# Altium project EaglesPU50.PrjPcb
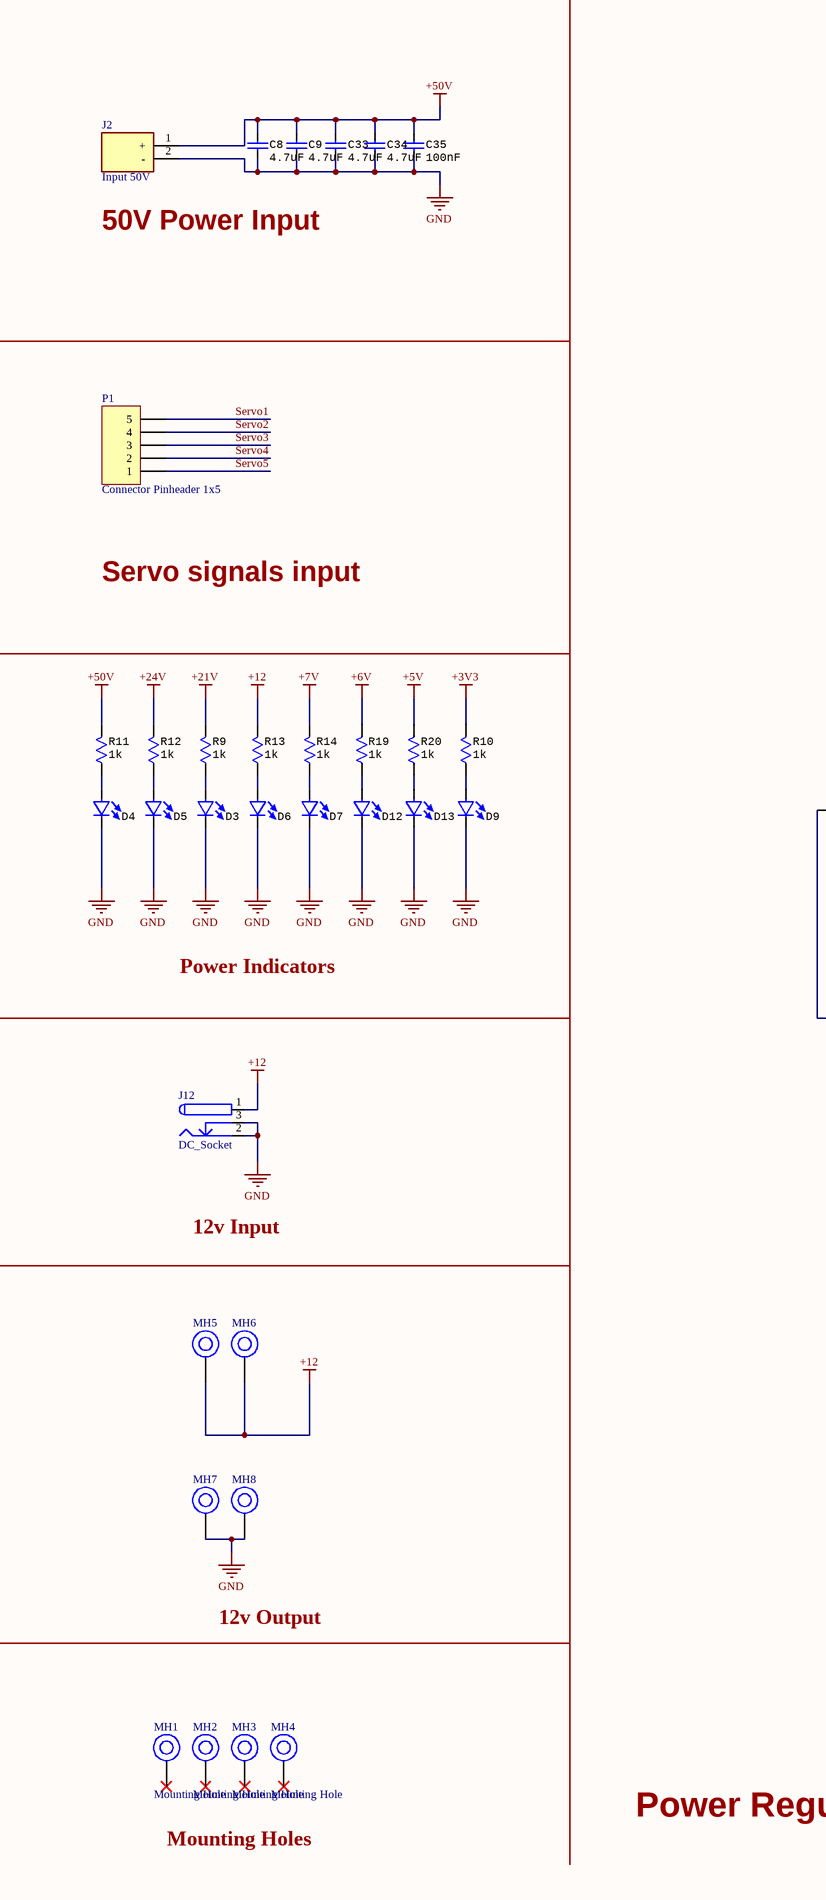
[diagram p0: EaglesPU50.SchDoc, left]
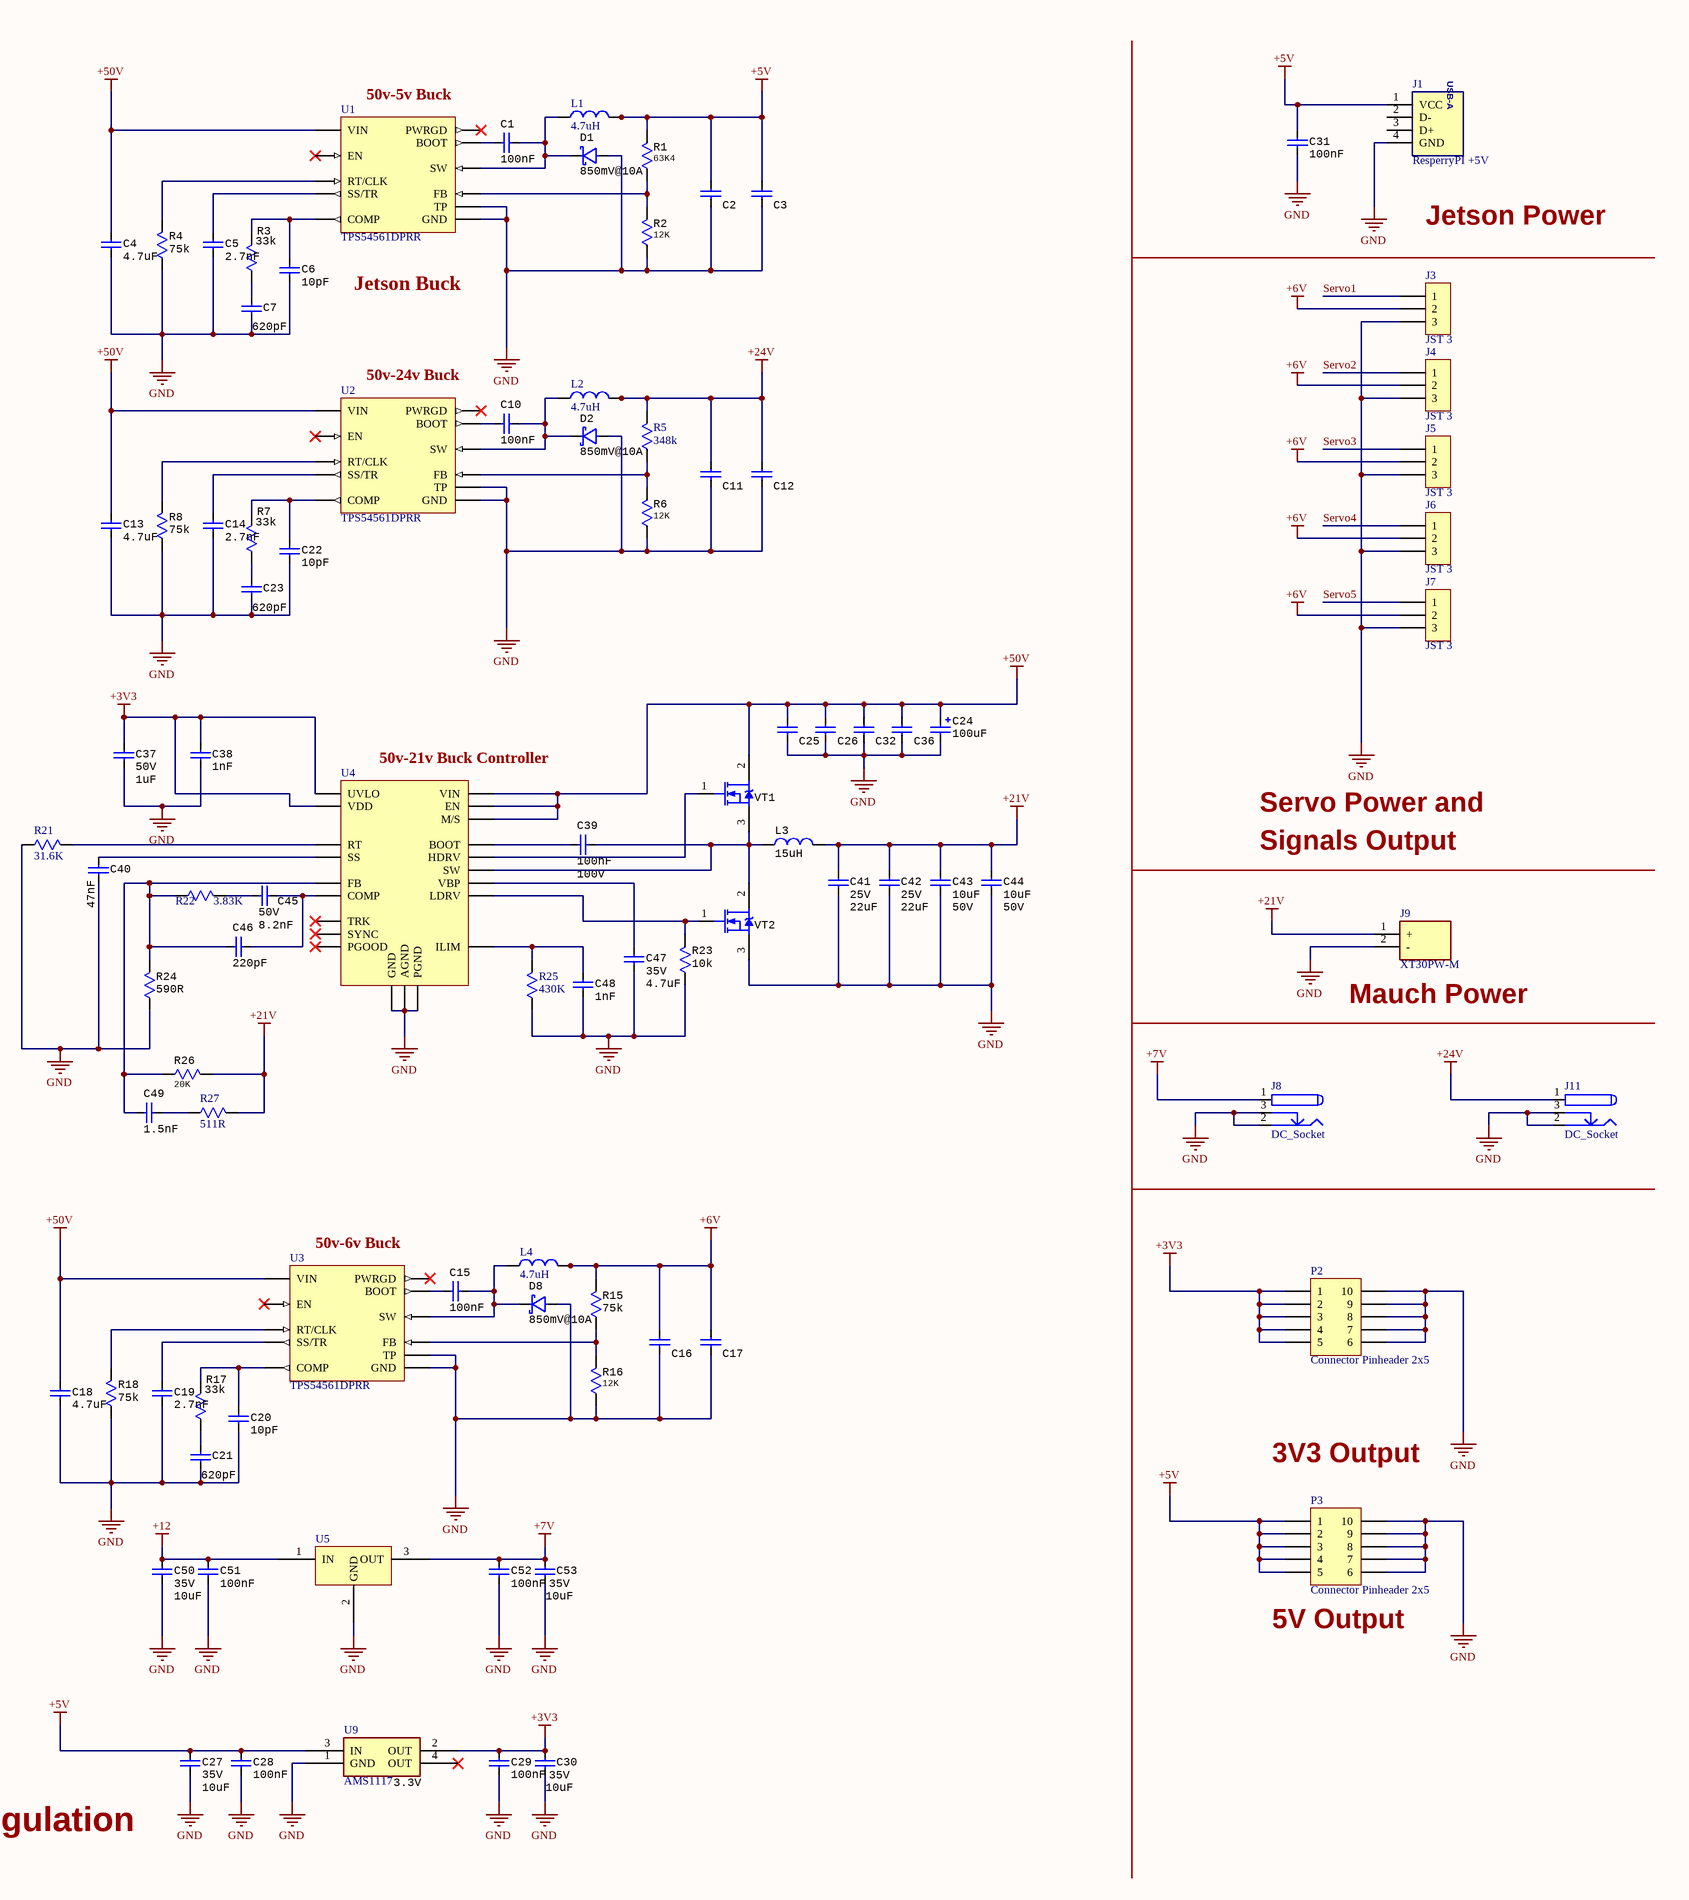
[diagram p1: EaglesPU50.SchDoc, right]
1 sheet, 125 parts. Net scope: global (net labels, ports and power ports of the same name join across sheets).
Board file: PU50.PcbDoc

## Sheet EaglesPU50.SchDoc
size C; SheetNumber: 1; SheetTotal: 1

### Parts
C1  100nF  [CAP Ceramic SMD 0603]
C2  (no value)  [CAP Ceramic SMD 1206]
C3  (no value)  [CAP Ceramic SMD 1206]
C4  4.7uF  [CAP Ceramic SMD 1206]
C5  2.7nF  [CAP Ceramic SMD 0603]
C6  10pF  [CAP Ceramic SMD 0603]
C7  620pF  [CAP Ceramic SMD 0603]
C8  4.7uF  [CAP Ceramic SMD 1206]
C9  4.7uF  [CAP Ceramic SMD 1206]
C10  100nF  [CAP Ceramic SMD 0603]
C11  (no value)  [CAP Ceramic SMD 1206]
C12  (no value)  [CAP Ceramic SMD 1206]
C13  4.7uF  [CAP Ceramic SMD 1206]
C14  2.7nF  [CAP Ceramic SMD 0603]
C15  100nF  [CAP Ceramic SMD 0603]
C16  (no value)  [CAP Ceramic SMD 1206]
C17  (no value)  [CAP Ceramic SMD 1206]
C18  4.7uF  [CAP Ceramic SMD 1206]
C19  2.7nF  [CAP Ceramic SMD 0603]
C20  10pF  [CAP Ceramic SMD 0603]
C21  620pF  [CAP Ceramic SMD 0603]
C22  10pF  [CAP Ceramic SMD 0603]
C23  620pF  [CAP Ceramic SMD 0603]
C24  100uF  [CAP Electrolytic SMD G_10X10.3X10.2(CPOL-EU153CLV-1010)]
C25  2.2uF  [CAP Ceramic SMD 1206]  (value not drawn)
C26  2.2uF  [CAP Ceramic SMD 1206]  (value not drawn)
C27  Voltage: 35V  [CAP Ceramic SMD 0603]  (hidden comment: 10uF)
C28  100nF  [CAP Ceramic SMD 0603]
C29  100nF  [CAP Ceramic SMD 0603]
C30  Voltage: 35V  [CAP Ceramic SMD 0603]  (hidden comment: 10uF)
C31  100nF  [CAP Ceramic SMD 0603]
C32  2.2uF  [CAP Ceramic SMD 1206]  (value not drawn)
C33  4.7uF  [CAP Ceramic SMD 1206]
C34  4.7uF  [CAP Ceramic SMD 1206]
C35  100nF  [CAP Ceramic SMD 0603]
C36  2.2uF  [CAP Ceramic SMD 1206]  (value not drawn)
C37  value 1uF  Voltage: 50V  [CAP Ceramic SMD 0603]
C38  1nF  [CAP Ceramic SMD 0603]
C39  value 100nF  Voltage: 100V  [CAP Ceramic SMD 0603]
C40  47nF  [CAP Ceramic SMD 0603]
C41  Voltage: 25V  [CAP Ceramic SMD 0805]  (hidden comment: 22uF)
C42  Voltage: 25V  [CAP Ceramic SMD 0805]  (hidden comment: 22uF)
C43  value 10uF  Voltage: 50V  [CAP Ceramic SMD 1206]
C44  value 10uF  Voltage: 50V  [CAP Ceramic SMD 1206]
C45  Voltage: 50V  [CAP Ceramic SMD 0603]  (hidden comment: 8.2nF)
C46  220pF  [CAP Ceramic SMD 0603]
C47  value 4.7uF  Voltage: 35V  [CAP Ceramic SMD 0603]
C48  1nF  [CAP Ceramic SMD 0603]
C49  1.5nF  [CAP Ceramic SMD 0603]
C50  Voltage: 35V  [CAP Ceramic SMD 0603]  (hidden comment: 10uF)
C51  100nF  [CAP Ceramic SMD 0603]
C52  100nF  [CAP Ceramic SMD 0603]
C53  Voltage: 35V  [CAP Ceramic SMD 0603]  (hidden comment: 10uF)
D1  850mV@10A  [TO-277]
D2  850mV@10A  [TO-277]
D3  (no value)  [LED SMD 0805G]
D4  (no value)  [LED SMD 0805G]
D5  (no value)  [LED SMD 0805G]
D6  (no value)  [LED SMD 0805G]
D7  (no value)  [LED SMD 0805G]
D8  850mV@10A  [TO-277]
D9  (no value)  [LED SMD 0805G]
D12  (no value)  [LED SMD 0805G]
D13  (no value)  [LED SMD 0805G]
J1  ResperryPI +5V  [USB-A/S_A]
J2  Input 50V  [XT60PW-M]
J3  JST 3  [VH3.96-3AW]
J4  JST 3  [VH3.96-3AW]
J5  JST 3  [VH3.96-3AW]
J6  JST 3  [VH3.96-3AW]
J7  JST 3  [VH3.96-3AW]
J8  DC_Socket  [DC-002]
J9  XT30PW-M  [AMASS_XT30PW-F]
J11  DC_Socket  [DC-002]
J12  DC_Socket  [DC-002]
L1  4.7uH  [XLS1040]
L2  4.7uH  [XLS1040]
L3  15uH  [MDA1365-150M]
L4  4.7uH  [XLS1040]
MH1  Mounting Hole  [Connector Mounting hole TH 3mm]  (no BOM)
MH2  Mounting Hole  [Connector Mounting hole TH 3mm]  (no BOM)
MH3  Mounting Hole  [Connector Mounting hole TH 3mm]  (no BOM)
MH4  Mounting Hole  [Connector Mounting hole TH 3mm]  (no BOM)
MH5  Mounting Hole  [Connector Mounting hole TH 1mm SOLID]  (value not drawn)  (no BOM)
MH6  Mounting Hole  [Connector Mounting hole TH 1mm SOLID]  (value not drawn)  (no BOM)
MH7  Mounting Hole  [Connector Mounting hole TH 1mm SOLID]  (value not drawn)  (no BOM)
MH8  Mounting Hole  [Connector Mounting hole TH 1mm SOLID]  (value not drawn)  (no BOM)
P1  Connector Pinheader 1x5  [Header 2.54X5]
P2  Connector Pinheader 2x5  [Header 2.54_2X5]
P3  Connector Pinheader 2x5  [Header 2.54_2X5]
R1  63K4  [RES SMD 0603]
R2  12K  [RES SMD 0603]
R3  33k  [RES SMD 0603]
R4  value 75k  [RES SMD 0603]  (hidden comment: 75kR)
R5  348k  [RES SMD 0805]
R6  12K  [RES SMD 0603]
R7  33k  [RES SMD 0603]
R8  value 75k  [RES SMD 0603]  (hidden comment: 75kR)
R9  value 1k  [RES SMD 0603]  (hidden comment: 1kR)
R10  value 1k  [RES SMD 0603]  (hidden comment: 1kR)
R11  value 1k  [RES SMD 0603]  (hidden comment: 1kR)
R12  value 1k  [RES SMD 0603]  (hidden comment: 1kR)
R13  value 1k  [RES SMD 0603]  (hidden comment: 1kR)
R14  value 1k  [RES SMD 0603]  (hidden comment: 1kR)
R15  value 75k  [RES SMD 0603]  (hidden comment: 75kR)
R16  12K  [RES SMD 0603]
R17  33k  [RES SMD 0603]
R18  value 75k  [RES SMD 0603]  (hidden comment: 75kR)
R19  value 1k  [RES SMD 0603]  (hidden comment: 1kR)
R20  value 1k  [RES SMD 0603]  (hidden comment: 1kR)
R21  31.6K  [RES SMD 0603]
R22  3.83K  [RES SMD 0603]
R23  10k  [RES SMD 0603]
R24  590R  [RES SMD 0603]
R25  430K  [RES SMD 0805]
R26  20K  [RES SMD 0603]
R27  511R  [RES SMD 0603]
U1  TPS54561DPRR  [TPS54561DPRR]
U2  TPS54561DPRR  [TPS54561DPRR]
U3  TPS54561DPRR  [TPS54561DPRR]
U4  TPS40170RGYR  [TPS40170RGYR]  (value not drawn)
U5  BA7807FP-E2  [BA7807FP-E2]  (value not drawn)
U9  AMS1117  Voltage output: 3.3V  [Linear reagulator SMD AMS1117 - duplicate]
VT1  SL15N65CD  [TO252]  (value not drawn)
VT2  SL15N65CD  [TO252]  (value not drawn)

### Nets
+3V3: C29.1 C30.1 C37.1 C38.1 P2.1 P2.2 P2.3 P2.4 P2.5 R10.2 U4.10(VDD) U4.20(UVLO) U9.2(OUT)
+5V: C2.1 C3.1 C27.1 C28.1 C31.1 J1.1(VCC) L1.1 P3.1 P3.2 P3.3 P3.4 P3.5 R1.2 R20.2 U9.3(IN)
+6V: C16.1 C17.1 J3.2 J4.2 J5.2 J6.2 J7.2 L4.1 R15.2 R19.2
+7V: C52.1 C53.1 J8.1 R14.2 U5.3(OUT)
+12: C50.1 C51.1 J12.1 MH5.1 MH6.1 R13.2 U5.1(IN)
+21V: C41.1 C42.1 C43.1 C44.1 J9.1(+) L3.1 R9.2 R26.2 R27.2
+24V: C11.1 C12.1 J11.1 L2.1 R5.2 R12.2
+50V: C4.1 C8.1 C9.1 C13.1 C18.1 C24.1 C25.1 C26.1 C32.1 C33.1 C34.1 C35.1 C36.1 J2.1(+) R11.2 U1.2(VIN) U2.2(VIN) U3.2(VIN) U4.1(EN) U4.3(M/S) U4.19(VIN) VT1.2(D)
GND: C2.2 C3.2 C4.2 C5.2 C6.2 C7.2 C8.2 C9.2 C11.2 C12.2 C13.2 C14.2 C16.2 C17.2 C18.2 C19.2 C20.2 C21.2 C22.2 C23.2 C24.2 C25.2 C26.2 C27.2 C28.2 C29.2 C30.2 C31.2 C32.2 C33.2 C34.2 C35.2 C36.2 C37.2 C38.2 C40.2 C41.2 C42.2 C43.2 C44.2 C47.2 C48.2 C50.2 C51.2 C52.2 C53.2 D1.A D2.A D3.2 D4.2 D5.2 D6.2 D7.2 D8.A D9.2 D12.2 D13.2 J1.4(GND) J2.2(-) J3.3 J4.3 J5.3 J6.3 J7.3 J8.2 J8.3 J9.2(-) J11.2 J11.3 J12.2 J12.3 MH7.1 MH8.1 P2.6 P2.7 P2.8 P2.9 P2.10 P3.6 P3.7 P3.8 P3.9 P3.10 R2.1 R4.1 R6.1 R8.1 R16.1 R18.1 R21.1 R23.1 R24.1 R25.1 U1.8(GND) U1.11(TP) U2.8(GND) U2.11(TP) U3.8(GND) U3.11(TP) U4.9(AGND) U4.13(PGND) U4.21(GND) U5.2(GND) U9.1(GND) VT2.3(S)
Servo1: J3.1 P1.5
Servo2: J4.1 P1.4
Servo3: J5.1 P1.3
Servo4: J6.1 P1.2
Servo5: J7.1 P1.1
NetC1_1: C1.1 U1.1(BOOT)
NetC1_2: C1.2 D1.C L1.2 U1.9(SW)
NetC5_1: C5.1 U1.4(SS/TR)
NetC6_1: C6.1 R3.2 U1.7(COMP)
NetC7_1: C7.1 R3.1
NetC10_1: C10.1 U2.1(BOOT)
NetC10_2: C10.2 D2.C L2.2 U2.9(SW)
NetC14_1: C14.1 U2.4(SS/TR)
NetC15_1: C15.1 U3.1(BOOT)
NetC15_2: C15.2 D8.C L4.2 U3.9(SW)
NetC19_1: C19.1 U3.4(SS/TR)
NetC20_1: C20.1 R17.2 U3.7(COMP)
NetC21_1: C21.1 R17.1
NetC22_1: C22.1 R7.2 U2.7(COMP)
NetC23_1: C23.1 R7.1
NetC39_1: C39.1 U4.18(BOOT)
NetC39_2: C39.2 L3.2 U4.16(SW) VT1.3(S) VT2.2(D)
NetC40_1: C40.1 U4.5(SS)
NetC45_1: C45.1 C46.2 U4.8(COMP)
NetC45_2: C45.2 R22.2
NetC46_1: C46.1 C49.1 R22.1 R24.2 R26.1 U4.7(FB)
NetC47_1: C47.1 U4.15(VBP)
NetC48_1: C48.1 R25.2 U4.12(ILIM)
NetC49_2: C49.2 R27.1
NetD3_1: D3.1 R9.1
NetD4_1: D4.1 R11.1
NetD5_1: D5.1 R12.1
NetD6_1: D6.1 R13.1
NetD7_1: D7.1 R14.1
NetD9_1: D9.1 R10.1
NetD12_1: D12.1 R19.1
NetD13_1: D13.1 R20.1
NetR1_1: R1.1 R2.2 U1.6(FB)
NetR4_2: R4.2 U1.5(RT/CLK)
NetR5_1: R5.1 R6.2 U2.6(FB)
NetR8_2: R8.2 U2.5(RT/CLK)
NetR15_1: R15.1 R16.2 U3.6(FB)
NetR18_2: R18.2 U3.5(RT/CLK)
NetR21_2: R21.2 U4.4(RT)
NetR23_2: R23.2 U4.14(LDRV) VT2.1(G)
NetU4_17: U4.17(HDRV) VT1.1(G)

Not connected (* = marked no-connect by the designer): J1 2(D-) 3(D+); MH1 1*; MH2 1*; MH3 1*; MH4 1*; U1 3(EN)* 10(PWRGD)*; U2 3(EN)* 10(PWRGD)*; U3 3(EN)* 10(PWRGD)*; U4 2(SYNC)* 6(TRK)* 11(PGOOD)*; U9 4(OUT)*

### Notes on the sheet
- (near U1) 50v-5v Buck
- 50V Power Input
- Jetson Power
- Jetson Buck
- (near U2) 50v-24v Buck
- Servo signals input
- (near U4) 50v-21v Buck Controller
- Servo Power and
- Signals Output
- Power Indicators
- (near J9) Mauch Power
- 12v Input
- (near U3) 50v-6v Buck
- 3V3 Output
- 12v Output
- (near P3) 5V Output
- Mounting Holes
- Power Regulation
- (in symbol Connector_USB-A) USB-A

### Library data of the parts
C1 C10 C15 C31 C35 = CAP 0603 100nF 100V: 0603 0.1 uF 100 V ±10% Tolerance X7R Multilayer Ceramic Capacitor; Manufacturer: Yageo; Manufacturer Part Number: CC0603KRX7R0BB104; Voltage Rating: 100V; RoHS: Yes; Category: Ceramic Capacitors; Stock 1: 6927977; Pricing 1: 1=0.17000, 10=0.11900, 50=0.06760, 100=0.05590, 500=0.03922, 1000=0.03246 (USD); Mount: Surface Mount; Case/Package: 0603; Case Code (Metric): 1608; Case Code (Imperial): 0603; Weight: 7.1E-05oz; Min Operating Temperature: -55°C; Max Operating Temperature: 125°C; Package Quantity: 4000; Capacitance: 100nF; Tolerance: 10%; Packaging: Tape and Reel; Dielectric: X7R; Termination: SMD/SMT; Resistor Type: Ceramic; Voltage Rating (DC): 100V; Series: CC; Length: 0.063inch; Width: 0.031inch; Thickness: 0.035inch; Depth: 0.8mm; Lead Free: Lead Free; RoHS Compliant: Yes; ComponentLink1URL: https://datasheet.ciiva.com/6277/mlccorderingcode-6277082.pdf?src-supplier=Digi-Key; ComponentLink1Description: https://datasheet.ciiva.com/6277/mlccorderingcode-6277082.pdf?src-supplier=Digi-Key; ComponentLink2URL: https://datasheet.ciiva.com/6277/mlccorderingcode-6277081.pdf?src-supplier=Digi-Key; ComponentLink2Description: https://datasheet.ciiva.com/6277/mlccorderingcode-6277081.pdf?src-supplier=Digi-Key; ComponentLink3URL: https://datasheet.ciiva.com/6277/mlccorderingcode-6277030.pdf?src-supplier=Digi-Key; ComponentLink3Description: https://datasheet.ciiva.com/6277/mlccorderingcode-6277030.pdf?src-supplier=Digi-Key; Supplier 1: LCSC; Supplier Part Number 1: C113803
C2 C3 C11 C12 C16 C17 = CAP 1206 47uF 10V X5R: 10V 22uF X7R ±10% 1206 Multilayer Ceramic Capacitors MLCC - SMD/SMT ROHS; Manufacturer: Samsung; Manufacturer Part Number: GRM31CR61A476ME15L; Value: 47uF; Temperature Characteristics Code: X5R; Supplier: LCSC; Supplier Part Number: C94034; Case/Package: 1206; Voltage Rating: 10V
C4 C8 C9 C13 C18 C33 C34 = CAP 1206 4.7uF 100V: Cap Ceramic 4.7uF 100V X7S 10% SMD 1206 125°C Emboss T/R; Manufacturer Part Number: GRM31CC72A475KE11L; Manufacturer: Murata; Category: Ceramic Capacitors; RoHS Compliant: Yes; Supplier: LCSC; Supplier Part Number: C237304; Capacitance: 4.7uF; Supplier 1: LCSC; Supplier Part Number 1: C237304; RoHS: Yes; Stock 1: 20335; Pricing 1: 5=0.31360, 50=0.26070, 150=0.23810, 500=0.15950, 2000=0.14990, 4000=0.14420 (USD); ComponentLink1URL: https://search.murata.co.jp/Ceramy/image/img/A01X/G101/ENG/GRM31CC72A475KE11-01A.pdf?src-supplier=Digi-Key; ComponentLink1Description: https://search.murata.co.jp/Ceramy/image/img/A01X/G101/ENG/GRM31CC72A475KE11-01A.pdf?src-supplier=Digi-Key
C5 C14 C19 = CAP 0603 2.7nF 50V: 0603 2.7 nF 50 V ±10 % Tolerance X7R SMT Multilayer Ceramic Capacitor; Manufacturer: Yageo; Manufacturer Part Number: CC0603KRX7R9BB272; Tolerance: 10%; Voltage Rating (DC): 50V; Insulation Resistance: 100GR; Supplier 1: LCSC; Supplier Part Number 1: C107085; RoHS: Yes; Category: Ceramic Capacitors; Stock 1: 143654; Pricing 1: 1=0.10000, 10=0.06100, 50=0.03320, 100=0.02710, 500=0.01934, 1000=0.01519 (USD); Mount: Surface Mount; Case/Package: 0603; Case Code (Imperial): 0603; Case Code (Metric): 1608; Dielectric Material: Ceramic; Min Operating Temperature: -55°C; Max Operating Temperature: 125°C; Capacitance: 2.7nF; Dielectric: X7R; Voltage Rating: 50V; Packaging: Tape and Reel; Termination: SMD/SMT; Resistor Type: Ceramic; Voltage: 50V; Series: CC; Construction: Flat; Length: 1.6mm; Width: 0.031inch; Height: 0.8mm; Thickness: 0.035inch; Depth: 0.8mm; Radiation Hardening: No; Lead Free: Lead Free; Halogen Free: Halogen Free; RoHS Compliant: Yes; ComponentLink1URL: https://datasheet.ciiva.com/11786/0900766b80d84f1d-11786435.pdf?src-supplier=RSComponents; ComponentLink1Description: https://datasheet.ciiva.com/11786/0900766b80d84f1d-11786435.pdf?src-supplier=RSComponents; ComponentLink2URL: https://datasheet.ciiva.com/8033/1489800-8033877.pdf?src-supplier=Element14; ComponentLink2Description: https://datasheet.ciiva.com/8033/1489800-8033877.pdf?src-supplier=Element14; ComponentLink3URL: https://datasheet.ciiva.com/13210/upy-gphc-x7r-6-3v-to-50v-8-12304-13210203.pdf?src-supplier=Mouser; ComponentLink3Description: https://datasheet.ciiva.com/13210/upy-gphc-x7r-6-3v-to-50v-8-12304-13210203.pdf?src-supplier=Mouser; ComponentLink4URL: https://datasheet.ciiva.com/11465/upy-gphc-x7r-6-3v-to-50v-8-11465237.pdf?src-supplier=Avnet; ComponentLink4Description: https://datasheet.ciiva.com/11465/upy-gphc-x7r-6-3v-to-50v-8-11465237.pdf?src-supplier=Avnet; ComponentLink5URL: https://datasheet.ciiva.com/26829/getdatasheetpartid-134617-26829446.pdf?src-supplier=Verical; ComponentLink5Description: https://datasheet.ciiva.com/26829/getdatasheetpartid-134617-26829446.pdf?src-supplier=Verical
C6 C20 C22 = CAP 0603 10pF 50V: Surface Mount Ceramic Multilayer Capacitor 10pF 5% C0G 50V 0603 Paper T/R; Manufacturer: Yageo; Manufacturer Part Number: CC0603JRNPO9BN100; Temperature Coefficient: 30ppm/°C; Insulation Resistance: 100GR; Capacitance: 10pF; Supplier Part Number 1: C106245; RoHS: Yes; Category: Ceramic Capacitors; Stock 1: 1278240; Pricing 1: 1=0.10000, 10=0.03600, 50=0.01960, 100=0.01590, 500=0.01138, 1000=0.00894 (USD); Mounting Technology: Surface Mount; Case/Package: 0603; Pins: 2; Case Code (Metric): 1608; Case Code (Imperial): 0603; Min Operating Temperature: -55°C; Max Operating Temperature: 125°C; Tolerance: 5%; Dielectric: C0G; Voltage: 50V; Voltage Rating: 50V; Voltage Rating (DC): 50V; Packaging: Tape and Reel; Package Quantity: 4000; Termination: SMD/SMT; Resistor Type: Ceramic; Series: CC; Length: 1.6mm; Width: 0.8mm; Height: 0.8mm; Thickness: 0.035inch; Depth: 0.8mm; Radiation Hardening: No; RoHS Compliant: Yes; Reach SVHC Compliant: Yes; Lead Free: Lead Free; ComponentLink1URL: https://datasheet.ciiva.com/144/mlccorderingcode-144651.pdf?src-supplier=Digi-Key; ComponentLink1Description: https://datasheet.ciiva.com/144/mlccorderingcode-144651.pdf?src-supplier=Digi-Key; ComponentLink2URL: https://datasheet.ciiva.com/5789/1734582-5789616.pdf?src-supplier=Farnell; ComponentLink2Description: https://datasheet.ciiva.com/5789/1734582-5789616.pdf?src-supplier=Farnell; ComponentLink3URL: https://datasheet.ciiva.com/26862/getdatasheetpartid-403524-26862758.pdf?src-supplier=Verical; ComponentLink3Description: https://datasheet.ciiva.com/26862/getdatasheetpartid-403524-26862758.pdf?src-supplier=Verical; ComponentLink4URL: https://datasheet.ciiva.com/11786/0900766b8079c870-11786407.pdf?src-supplier=Rs; ComponentLink4Description: https://datasheet.ciiva.com/11786/0900766b8079c870-11786407.pdf?src-supplier=Rs; ComponentLink5URL: https://datasheet.ciiva.com/7978/1132289-7978126.pdf?src-supplier=Element14; ComponentLink5Description: https://datasheet.ciiva.com/7978/1132289-7978126.pdf?src-supplier=Element14; ComponentLink6URL: https://datasheet.ciiva.com/46430/1835847-46430150.pdf?src-supplier=Element14; ComponentLink6Description: https://datasheet.ciiva.com/46430/1835847-46430150.pdf?src-supplier=Element14; ComponentLink7URL: https://datasheet.ciiva.com/144/mlccorderingcode-144650.pdf?src-supplier=Digi-Key; ComponentLink7Description: https://datasheet.ciiva.com/144/mlccorderingcode-144650.pdf?src-supplier=Digi-Key; ComponentLink8URL: https://datasheet.ciiva.com/144/mlccorderingcode-144649.pdf?src-supplier=Digi-Key; ComponentLink8Description: https://datasheet.ciiva.com/144/mlccorderingcode-144649.pdf?src-supplier=Digi-Key; ComponentLink9URL: https://datasheet.ciiva.com/5425/upy-gp-np0-16v-to-50v-8-5425564.pdf?src-supplier=Mouser; ComponentLink9Description: https://datasheet.ciiva.com/5425/upy-gp-np0-16v-to-50v-8-5425564.pdf?src-supplier=Mouser; ComponentLink10URL: https://datasheet.ciiva.com/8033/1734582-8033710.pdf?src-supplier=Element14; ComponentLink10Description: https://datasheet.ciiva.com/8033/1734582-8033710.pdf?src-supplier=Element14; ComponentLink11URL: https://datasheet.ciiva.com/8033/1734582-8033706.pdf?src-supplier=Element14; ComponentLink11Description: https://datasheet.ciiva.com/8033/1734582-8033706.pdf?src-supplier=Element14; Supplier 1: LCSC; Value: 10pF
C7 C21 C23 = CAP 0603 620pF 50V: Surface Mount Ceramic Multilayer Capacitor 620pF 5% C0G 50V 0603 Paper T/R; Manufacturer: Yageo; Manufacturer Part Number: CC0603JRNPO9BN621; Supplier 1: LCSC; Supplier Part Number 1: C325470; RoHS: Yes; Category: Ceramic Capacitors; Stock 1: 28329; Pricing 1: 1=0.26000, 10=0.17600, 50=0.10560, 100=0.08920, 500=0.06102, 1000=0.05399 (USD); Mounting Technology: Surface Mount; Case/Package: 0603; Case Code (Imperial): 0603; Case Code (Metric): 1608; Weight: 7.1E-05oz; Min Operating Temperature: -55°C; Max Operating Temperature: 125°C; Value: 620pF; Voltage Rating (DC): 50V; Tolerance: 5%; Packaging: Tape and Reel; Dielectric: C0G; Voltage Rating: 50V; Termination: SMD/SMT; Resistor Type: Ceramic; Series: CC; Length: 0.063inch; Width: 0.031inch; Thickness: 0.035inch; ComponentLink1URL: https://datasheet.ciiva.com/13265/upy-gp-np0-16v-to-50v-8-3714-13265463.pdf?src-supplier=Mouser; ComponentLink1Description: https://datasheet.ciiva.com/13265/upy-gp-np0-16v-to-50v-8-3714-13265463.pdf?src-supplier=Mouser
C24 = CAP ELEC 100uF 68V: -40℃~+105℃ 2000hrs@105℃ 100uF 10.2mm 63V 10mm ±20% SMD,D10xL10.2mm Aluminum Electrolytic Capacitors - SMD ROHS; Manufacturer: ROQANG; Manufacturer Part Number: RT1J101M1010; ComponentLink1Description: Datasheet; ComponentLink1URL: https://datasheet.lcsc.com/lcsc/1809061214_Nichicon-UWX1C101MCL1GB_C111600.pdf; Supplier: LCSC; Supplier Part Number: C280414; Capacitance: 100uF
C25 C26 C32 C36 = CAP 1206 2.2uF 100V: 100V 2.2uF X7R ±10% 1206 Multilayer Ceramic Capacitors MLCC - SMD/SMT ROHS; Manufacturer: Yageo; Manufacturer Part Number: CC1206KKX7R0BB225; Supplier: LCSC; Supplier Part Number: C577211
C27 C30 C50 C53 = CAP 0603 10uF 35V: Cap Ceramic 10uF 35V X5R 20% Pad SMD 0603 85C T/R; Manufacturer: Murata; Manufacturer Part Number: GRM188R6YA106MA73D; Supplier 1: LCSC; RoHS: Yes; Category: Ceramic Capacitors; Mount: Surface Mount; Case/Package: 0603; Case Code (Metric): 1608; Case Code (Imperial): 0603; Min Operating Temperature: -55°C; Max Operating Temperature: 85°C; Packaging: Tape and Reel; Capacitance: 10uF; Voltage Rating: 35V; Tolerance: 20%; Dielectric: X5R; Voltage Rating (DC): 35V; Length: 0.063inch; Width: 0.031inch; Thickness: 0.039inch; RoHS Compliant: Yes; ComponentLink1URL: http://search.murata.co.jp/Ceramy/image/img/A01X/G101/ENG/GRM188R6YA106MA73-01.pdf?src-supplier=Future+Electronics; ComponentLink1Description: http://search.murata.co.jp/Ceramy/image/img/A01X/G101/ENG/GRM188R6YA106MA73-01.pdf?src-supplier=Future+Electronics; ComponentLink2URL: http://search.murata.co.jp/Ceramy/image/img/A01X/G101/ENG/GRM188R6YA106MA73-01.pdf?src-supplier=Digi-Key; ComponentLink2Description: http://search.murata.co.jp/Ceramy/image/img/A01X/G101/ENG/GRM188R6YA106MA73-01.pdf?src-supplier=Digi-Key; ComponentLink3URL: https://www.murata.com/~/media/webrenewal/support/library/catalog/products/capacitor/mlcc/c02e.ashx?la=en-us&src-supplier=Digi-Key; ComponentLink3Description: https://www.murata.com/~/media/webrenewal/support/library/catalog/products/capacitor/mlcc/c02e.ashx?la=en-us&src-supplier=Digi-Key; ComponentLink4URL: http://search.murata.co.jp/Ceramy/image/img/A01X/G101/ENG/GRM188R6YA106MA73-01.pdf?src-supplier=Mouser; ComponentLink4Description: http://search.murata.co.jp/Ceramy/image/img/A01X/G101/ENG/GRM188R6YA106MA73-01.pdf?src-supplier=Mouser; ComponentLink5URL: http://search.murata.co.jp/Ceramy/image/img/A01X/G101/ENG/GRM188R6YA106MA73-01.pdf?src-supplier=TTI; ComponentLink5Description: http://search.murata.co.jp/Ceramy/image/img/A01X/G101/ENG/GRM188R6YA106MA73-01.pdf?src-supplier=TTI; Supplier Part Number 1: C194427; Value: 10uF
C28 C29 C51 C52 = CAP 0603 100nF 100V: 0603 0.1 uF 100 V ±10% Tolerance X7R Multilayer Ceramic Capacitor; Manufacturer: Yageo; Manufacturer Part Number: AC0603KRX7R0BB104; Voltage Rating: 100V; Supplier: LCSC; Supplier Part Number: C408909; RoHS: Yes; Category: Ceramic Capacitors; Stock 1: 6927977; Pricing 1: 1=0.17000, 10=0.11900, 50=0.06760, 100=0.05590, 500=0.03922, 1000=0.03246 (USD); Mount: Surface Mount; Case/Package: 0603; Case Code (Metric): 1608; Case Code (Imperial): 0603; Weight: 7.1E-05oz; Min Operating Temperature: -55°C; Max Operating Temperature: 125°C; Package Quantity: 4000; Capacitance: 100nF; Tolerance: 10%; Packaging: Tape and Reel; Dielectric: X7R; Termination: SMD/SMT; Resistor Type: Ceramic; Voltage Rating (DC): 100V; Series: CC; Length: 0.063inch; Width: 0.031inch; Thickness: 0.035inch; Depth: 0.8mm; Lead Free: Lead Free; RoHS Compliant: Yes; ComponentLink1URL: https://datasheet.ciiva.com/6277/mlccorderingcode-6277082.pdf?src-supplier=Digi-Key; ComponentLink1Description: https://datasheet.ciiva.com/6277/mlccorderingcode-6277082.pdf?src-supplier=Digi-Key; ComponentLink2URL: https://datasheet.ciiva.com/6277/mlccorderingcode-6277081.pdf?src-supplier=Digi-Key; ComponentLink2Description: https://datasheet.ciiva.com/6277/mlccorderingcode-6277081.pdf?src-supplier=Digi-Key; ComponentLink3URL: https://datasheet.ciiva.com/6277/mlccorderingcode-6277030.pdf?src-supplier=Digi-Key; ComponentLink3Description: https://datasheet.ciiva.com/6277/mlccorderingcode-6277030.pdf?src-supplier=Digi-Key
C37 = CAP 0603 1uF 50V X7R 10%: 50V 1uF X7R ±10% 0603 Multilayer Ceramic Capacitors MLCC - SMD/SMT ROHS; Manufacturer: YAGEO; Manufacturer Part Number: CC0603KRX7R9BB105; Supplier: LCSC; Temperature Characteristics Code: X7R; Supplier Part Number: C559769
C38 C48 = CAP 0603 1nF 50V: CAP CER 1100PF 50V C0G/NP0 0603; Manufacturer: YAGEO; Manufacturer Part Number: CC0603KRX7R9BB102; ComponentLink1URL: https://datasheet.ciiva.com/133/product-133472.pdf?src-supplier=Digi-Key; ComponentLink1Description: https://datasheet.ciiva.com/133/product-133472.pdf?src-supplier=Digi-Key; ComponentLink2URL: https://datasheet.ciiva.com/133/partnumbering-e-01-133471.pdf?src-supplier=Digi-Key; ComponentLink2Description: https://datasheet.ciiva.com/133/partnumbering-e-01-133471.pdf?src-supplier=Digi-Key; ComponentLink3URL: https://datasheet.ciiva.com/133/partnumbering-e-01-133473.pdf?src-supplier=Digi-Key; ComponentLink3Description: https://datasheet.ciiva.com/133/partnumbering-e-01-133473.pdf?src-supplier=Digi-Key; ComponentLink4URL: https://datasheet.ciiva.com/11621/product-11621253.pdf?src-supplier=Avnet; ComponentLink4Description: https://datasheet.ciiva.com/11621/product-11621253.pdf?src-supplier=Avnet; Capacitance: 1nF; Supplier: LCSC; Supplier Part Number: C100040; Voltage Rating: 50V
C39 = CAP 0603 100nF 100V X7R 10%: 100V 100nF X7R ±10% 0603 Multilayer Ceramic Capacitors MLCC - SMD/SMT ROHS; Manufacturer: Yageo; Manufacturer Part Number: CC0603KRX7R0BB104; Supplier: LCSC; Supplier Part Number: C113803; Temperature Characteristics Code: X7R
C40 = CAP 0603 47nF 50V: 50V 47nF X7R ±10% 0603 Multilayer Ceramic Capacitors MLCC - SMD/SMT ROHS; Manufacturer: Yageo; Manufacturer Part Number: CC0603KRX7R9BB473; ComponentLink1URL: https://datasheet.ciiva.com/13265/upy-gp-np0-16v-to-50v-8-3714-13265463.pdf?src-supplier=Mouser; ComponentLink1Description: https://datasheet.ciiva.com/13265/upy-gp-np0-16v-to-50v-8-3714-13265463.pdf?src-supplier=Mouser; Supplier: LCSC; Supplier Part Number: C107093
C41 C42 = CAP 0805 22uF 25V: 25V 22uF X5R ±20% 0805 Multilayer Ceramic Capacitors MLCC; Manufacturer: YAGEO; Manufacturer Part Number: CC0805MKX5R8BB226; Dielectric: X7R; ComponentLink10URL: https://datasheet.ciiva.com/25795/cl31b106kahnnne-25795260.pdf?src-supplier=Digi-Key; ComponentLink10Description: https://datasheet.ciiva.com/25795/cl31b106kahnnne-25795260.pdf?src-supplier=Digi-Key; ComponentLink11URL: https://datasheet.ciiva.com/26838/getdatasheetpartid-356415-26838914.pdf?src-supplier=Verical; ComponentLink11Description: https://datasheet.ciiva.com/26838/getdatasheetpartid-356415-26838914.pdf?src-supplier=Verical; ComponentLink12URL: https://datasheet.ciiva.com/16498/cl03a105mq3csnc-16498474.pdf?src-supplier=Future+Electronics; ComponentLink12Description: https://datasheet.ciiva.com/16498/cl03a105mq3csnc-16498474.pdf?src-supplier=Future+Electronics; Supplier: LCSC; RoHS: Yes; Category: Ceramic Capacitors; Stock 1: 663420; Pricing 1: 20=0.033200, 200=0.025500, 600=0.022100, 2000=0.019600, 10000=0.018600, 20000=0.017900 (AUD); Mount: Surface Mount; Case/Package: 0805; Case Code (Metric): 3216; Case Code (Imperial): 0805; Min Operating Temperature: -55°C; Max Operating Temperature: 125°C; Tolerance: 20%; Capacitance: 22uF; Packaging: Tape and Reel; Voltage Rating: 25V; Package Quantity: 1; Series: CL; Construction: Flat; Length: 3.2mm; Width: 0.063inch; Height: 1.6mm; Thickness: 0.071inch; Depth: 1.6mm; Radiation Hardening: No; RoHS Compliant: Yes; ComponentLink1URL: https://datasheet.ciiva.com/25795/cl31b106kahnnne-25795260.pdf?src-supplier=Digi-Key; ComponentLink1Description: https://datasheet.ciiva.com/25795/cl31b106kahnnne-25795260.pdf?src-supplier=Digi-Key; ComponentLink2URL: https://datasheet.ciiva.com/26838/getdatasheetpartid-356415-26838914.pdf?src-supplier=Verical; ComponentLink2Description: https://datasheet.ciiva.com/26838/getdatasheetpartid-356415-26838914.pdf?src-supplier=Verical; ComponentLink3URL: https://datasheet.ciiva.com/16498/cl03a105mq3csnc-16498474.pdf?src-supplier=Future+Electronics; ComponentLink3Description: https://datasheet.ciiva.com/16498/cl03a105mq3csnc-16498474.pdf?src-supplier=Future+Electronics; Supplier Part Number: C784585; Value: 22uF
C43 C44 = CAP 1206 10uF 50V X5R 10%: 50V 10uF X5R ±10% 1206 Multilayer Ceramic Capacitors MLCC - SMD/SMT ROHS; Manufacturer: Samsung; Manufacturer Part Number: CL31A106KBHNNNE; Supplier: LCSC; Supplier Part Number: C13585; Temperature Characteristics Code: X5R
C45 = CAP 0603 8.2nF 50V: 50V 8.2nF X7R ±10% 0603 Multilayer Ceramic Capacitors MLCC - SMD/SMT ROHS; Manufacturer: YAGEO; Manufacturer Part Number: CC0603KRX7R9BB822; Supplier: LCSC; Supplier Part Number: C113812; Capacitance: 8.2nF
C46 = CAP 0603 220pF 50V: 50V 220pF X7R ±10% 0603 Multilayer Ceramic Capacitors MLCC - SMD/SMT ROHS; Manufacturer: Yageo; Manufacturer Part Number: CC0603KRX7R9BB221; ComponentLink1URL: https://datasheet.ciiva.com/13265/upy-gp-np0-16v-to-50v-8-3714-13265463.pdf?src-supplier=Mouser; ComponentLink1Description: https://datasheet.ciiva.com/13265/upy-gp-np0-16v-to-50v-8-3714-13265463.pdf?src-supplier=Mouser; Supplier: LCSC; Supplier Part Number: C107081
C47 = CAP 0603 4.7uF 25V X5R 10%: 25V 4.7uF X5R ±10% 0603 Multilayer Ceramic Capacitors MLCC - SMD/SMT ROHS; Manufacturer: Samsung Electro-Mechanics; Manufacturer Part Number: CL10A475KA8NQNC; Supplier: LCSC; Supplier Part Number: C69335; Temperature Characteristics Code: X5R
C49 = CAP 0603 1.5nF 50V: 50V 1.5nF X7R ±10% 0603 Multilayer Ceramic Capacitors MLCC - SMD/SMT ROHS; Manufacturer: Yageo; Manufacturer Part Number: CC0603KRX7R9BB152; ComponentLink1URL: https://datasheet.ciiva.com/13265/upy-gp-np0-16v-to-50v-8-3714-13265463.pdf?src-supplier=Mouser; ComponentLink1Description: https://datasheet.ciiva.com/13265/upy-gp-np0-16v-to-50v-8-3714-13265463.pdf?src-supplier=Mouser; Supplier: LCSC; Supplier Part Number: C96090
D1 D2 D8 = Schottky 100V 750mV@10A: 100V 750mV@10A 10A TO-277 Schottky Barrier Diodes (SBD) ROHS; Manufacturer: MDD（Microdiode Electronics）; Manufacturer Part number: SB10100L; Vf@If: 850mV@10A; Supplier: LCSC; Supplier Part Number: C113946
D3-D7 D9 D12 D13 = LED 0805 Emerald: emerald 0805 Light Emitting Diodes (LED) ROHS; Manufacturer: FOSHAN Nationstar Optoelectronics; Manufacturer Part Number: NCD0805G1; Supplier: LCSC; Supplier Part Number: C84260; RoHS: No; Category: Uncategorized; Stock 1: 432460; Pricing 1: 20=0.01910, 200=0.01510, 600=0.01290, 3000=0.01160, 9000=0.01050, 21000=0.00990 (USD)
J1 = Connector_USB-A
J2 = XT60PW-M: Power Connectors ROHS; Manufacturer: Changzhou Amass Elec; ManufacturerPartNumber: XT60PW-M; Supplier: LCSC; SupplierPartNumber: C98732
J3-J7 = JST 3: MaleHeader 3x1
J8 J11 J12 = DC_Socket: CIRCULAR DC POWER CONNECTOR / Rated Current: 7.5A / Rated Volatage: 20VDC
J9 = XT30PW-M: Power Connectors ROHS; Manufacturer: Changzhou Amass Elec; Manufacturer Part Number: XT30PW-M; Supplier: LCSC; Supplier Part Number: C2913282
L1 L2 L4 = IND 0403 4.7uH 20%: 9A 4.7uH ±20% 17mΩ 15A SMD,11.5x10x3.8mm Power Inductors ROHS; Manufacturer: Cjiang; Manufacturer Part Number: FXL1040-4R7-M; Suppleir Part Number: C167230; Supplier: LCSC; ComponentLink1Description: LCSC; ComponentLink1URL: https://www.lcsc.com/product-detail/Power-Inductors_cjiang-Changjiang-Microelectronics-Tech-FXL1040-4R7-M_C167230.html
L3 = MDA1365-150M: 11A 15uH ±20% 13.5A 22mΩ SMD,12.6x13.5mm Inductors (SMD) ROHS; Manufacturer: KOHERelec; Manufacturer Part Number: MDA1365-150M; Supplier: LCSC; Supplier Part Number: C2847584; ComponentLink1Description: LCSC; ComponentLink1URL: https://www.lcsc.com/product-detail/Power-Inductors_cjiang-Changjiang-Microelectronics-Tech-FXL1040-4R7-M_C167230.html
P1 = Connector Pinheader 1x5: Header_5x1
P2 P3 = Connector Pinheader 2x5: Header_2X5
R1 = RES 0603 63K4 1%: 100mW Thick Film Resistors 75V ±100ppm/℃ ±1% -55℃~+155℃ 63.4kΩ 0603 Chip Resistor - Surface Mount ROHS; Manufacturer: Yageo; Manufacturer Part Number: AC0603FR-0763K4L; Resistance: 63.4kR; Temperature Coefficient: 100ppm/°C; Voltage Rating: 50V; Category: Chip SMD Resistors; Case Code (Imperial): 0603; Case Code (Metric): 1608; Case/Package: 0603; Construction: Rectangular; Depth: 0.8mm; Features: Moisture Resistant,Automotive AEC-Q200; Height: 0.022inch; Lead Free: Lead Free; Length: 0.063inch; Max Operating Temperature: 155°C; Max Power Dissipation: 100mW; Military Standard: Not; Min Operating Temperature: -55°C; Number of Pins: 2; Number of Terminations: 2; Package Quantity: 1; Packaging: Tape and Reel; Power Rating: 100mW; Reach SVHC Compliant: Yes; Resistance Tolerance: 1%; Resistor Type: Thick Film; RoHS Compliant: Yes; Series: RC; Size Code: 0603; Termination: SMD/SMT; Tolerance: 1%; Voltage Rating (DC): 50V; Width: 0.031inch; Supplier: LCSC; Supplier Part Number: C228003
R2 R6 R16 = RES 0603 12K 1%: 100mW Thick Film Resistors 75V ±100ppm/℃ ±1% -55℃~+155℃ 12kΩ 0603 Chip Resistor - Surface Mount ROHS; Manufacturer: Yageo; Manufacturer Part Number: RC0603FR-0712KL; Resistance: 12kR; Temperature Coefficient: 100ppm/°C; Voltage Rating: 50V; Category: Chip SMD Resistors; Case Code (Imperial): 0603; Case Code (Metric): 1608; Case/Package: 0603; Construction: Rectangular; Depth: 0.8mm; Features: Moisture Resistant; Height: 0.022inch; Lead Free: Lead Free; Length: 1.6mm; Max Operating Temperature: 155°C; Max Power Dissipation: 100mW; Military Standard: Not; Min Operating Temperature: -55°C; Number of Pins: 2; Number of Terminations: 2; Package Quantity: 1; Packaging: Tape and Reel; Power Rating: 100mW; Reach SVHC Compliant: Yes; Resistance Tolerance: 1%; Resistor Type: Thick Film; RoHS Compliant: Yes; Series: RC; Size Code: 0603; Termination: SMD/SMT; Tolerance: 1%; Voltage Rating (DC): 50V; Width: 0.8mm; Supplier: LCSC; Supplier Part Number: C114659
R3 R7 R17 = RES 0603 39k 1%: 100mW Thick Film Resistors 75V ±100ppm/℃ ±1% -55℃~+155℃ 39kΩ 0603 Chip Resistor - Surface Mount ROHS; Manufacturer: Uniroyal; Manufacturer Part Number: 0603WAF3902T5E; Supplier 1: LCSC; Supplier Part Number 1: C23153; RoHS: Yes; Stock 1: 490200; Pricing 1: 100=0.00100, 1000=0.00070, 5000=0.00060, 50000=0.00050 (USD); RoHS Compliant: Yes; Resistance: 33k
R4 R8 R15 R18 = RES 0603 75k 1%: Res Thick Film 0603 75K Ohm 1% 0.1W(1/10W) ±100ppm/C Pad SMD Automotive T/R; Manufacturer: Panasonic; Manufacturer Part Number: ERJ3RBD7502V; Tolerance: 0.5%; Temperature Coefficient: 50ppm/°C; Power Rating: 100mW; Voltage Rating: 50V; Supplier 1: LCSC; RoHS: Yes; Category: Chip SMD Resistors; Stock 1: 1820; Pricing 1: 20=0.002200, 200=0.001800, 600=0.001600, 2000=0.001400, 10000=0.001300, 20000=0.001300 (AUD); Mount: Surface Mount; Case/Package: 0603; Case Code (Metric): 1608; Case Code (Imperial): 0603; Min Operating Temperature: -55°C; Max Operating Temperature: 125°C; Packaging: Cut Tape; Resistance: 75kR; Resistor Type: Thick Film; Termination: Solder; Voltage Rating (DC): 50V; Length: 1.6mm; Height: 0.45mm; Depth: 0.8mm; RoHS Compliant: Yes; REACH SVHC: No SVHC; Military Standard: Not; ComponentLink1URL: http://www.farnell.com/datasheets/1911175.pdf?src-supplier=Farnell; ComponentLink1Description: http://www.farnell.com/datasheets/1911175.pdf?src-supplier=Farnell; ComponentLink2URL: https://industrial.panasonic.com/cdbs/www-data/pdf/RDM0000/DMM0000COL11.pdf?src-supplier=Digi-Key; ComponentLink2Description: https://industrial.panasonic.com/cdbs/www-data/pdf/RDM0000/DMM0000COL11.pdf?src-supplier=Digi-Key; ComponentLink3URL: http://www.farnell.com/datasheets/1911175.pdf?src-supplier=Element14; ComponentLink3Description: http://www.farnell.com/datasheets/1911175.pdf?src-supplier=Element14; ComponentLink4URL: http://www.farnell.com/datasheets/1678782.pdf?src-supplier=Element14; ComponentLink4Description: http://www.farnell.com/datasheets/1678782.pdf?src-supplier=Element14; Supplier Part Number 1: C336823; Supplier 2: LCSC; Stock 2: 800; Pricing 2: 50=0.009200, 500=0.007300, 1500=0.006200, 5000=0.005500, 25000=0.005000, 50000=0.004700 (AUD); Contact Plating: Tin; Number of Terminations: 2; Max Power Dissipation: 100mW; Series: ERJ; Package Quantity: 1; Features: Automotive AEC-Q200; Construction: Rectangular; Resistance Tolerance: 1%; Technology: THICK FILM; Width: 0.031inch; Radiation Hardening: No; Lead Free: Lead Free; ComponentLink5URL: https://datasheet.ciiva.com/34303/1988401-34303605.pdf?src-supplier=Jameco; ComponentLink5Description: https://datasheet.ciiva.com/34303/1988401-34303605.pdf?src-supplier=Jameco; ComponentLink6URL: https://datasheet.ciiva.com/46374/426256-46374235.pdf?src-supplier=Element14; ComponentLink6Description: https://datasheet.ciiva.com/46374/426256-46374235.pdf?src-supplier=Element14; ComponentLink7URL: https://datasheet.ciiva.com/28596/1678782-28596232.pdf?src-supplier=Element14; ComponentLink7Description: https://datasheet.ciiva.com/28596/1678782-28596232.pdf?src-supplier=Element14; ComponentLink8URL: https://datasheet.ciiva.com/28676/1678782-28676971.pdf?src-supplier=Element14; ComponentLink8Description: https://datasheet.ciiva.com/28676/1678782-28676971.pdf?src-supplier=Element14; ComponentLink9URL: https://datasheet.ciiva.com/24069/aoa0000ce2-24069064.pdf?src-supplier=Mouser; ComponentLink9Description: https://datasheet.ciiva.com/24069/aoa0000ce2-24069064.pdf?src-supplier=Mouser; ComponentLink10URL: https://datasheet.ciiva.com/9187/aoa0000ce2-9187719.pdf?src-supplier=Avnet; ComponentLink10Description: https://datasheet.ciiva.com/9187/aoa0000ce2-9187719.pdf?src-supplier=Avnet; ComponentLink11URL: https://datasheet.ciiva.com/48531/aoa0000ce2-48531550.pdf?src-supplier=Avnet; ComponentLink11Description: https://datasheet.ciiva.com/48531/aoa0000ce2-48531550.pdf?src-supplier=Avnet; ComponentLink12URL: https://datasheet.ciiva.com/31835/aoa0000ce2-31835674.pdf?src-supplier=Onlinecomponents.com; ComponentLink12Description: https://datasheet.ciiva.com/31835/aoa0000ce2-31835674.pdf?src-supplier=Onlinecomponents.com; ComponentLink13URL: https://datasheet.ciiva.com/15159/getdatasheetpartid-28812-15159210.pdf?src-supplier=Verical; ComponentLink13Description: https://datasheet.ciiva.com/15159/getdatasheetpartid-28812-15159210.pdf?src-supplier=Verical; Supplier Part Number 2: C403347
R5 = RES 0805 348k 1%: 125mW Thick Film Resistors ±100ppm/℃ ±1% 348kΩ 0805 Chip Resistor - Surface Mount ROHS; Manufacturer: PANASONIC; Manufacturer Part Number: ERJ6ENF3483V; Supplier: LCSC; Case/Package: 0805; Supplier Part Number: C400703; Resistance: 348k
R9-R14 R19 R20 = RES 0603 1k 1%: Res Thick Film 0603 1K Ohm 1% 1/10W ±100ppm/°C Molded SMD Punched Carrier T/R; Manufacturer: Panasonic; Manufacturer Part Number: ERJ3EKF1001V; Power Rating: 100mW; Voltage Rating: 75V; Supplier 1: LCSC; RoHS: Yes; Category: Chip SMD Resistors; Stock 1: 79650; Pricing 1: 50=0.009600, 500=0.008100, 1500=0.007300, 5000=0.006800, 25000=0.006400, 50000=0.006200 (AUD); Mount: Surface Mount; Case/Package: 0603; Number of Pins: 2; Case Code (Metric): 1608; Case Code (Imperial): 0603; Contact Plating: Tin; Size Code: 0603; Min Operating Temperature: -55°C; Max Operating Temperature: 155°C; Packaging: Tape and Reel; Resistance: 1kR; Resistor Type: Thick Film; Temperature Coefficient: 100ppm/°C; Series: ERJ; Tolerance: 1%; Number of Terminations: 2; Max Power Dissipation: 100mW; Construction: Rectangular; Features: Automotive AEC-Q200; Package Quantity: 5000; Termination: SMD/SMT; Voltage Rating (DC): 75V; Resistance Tolerance: 1%; Technology: THICK FILM; Length: 1.6mm; Width: 0.8mm; Height: 0.45mm; Depth: 0.8mm; Radiation Hardening: No; RoHS Compliant: Yes; Lead Free: Lead Free; Military Standard: Not; REACH SVHC: No SVHC; ComponentLink1URL: https://datasheet.ciiva.com/7942/aoa0000ce2-7942427.pdf?src-supplier=Element14; ComponentLink1Description: https://datasheet.ciiva.com/7942/aoa0000ce2-7942427.pdf?src-supplier=Element14; ComponentLink2URL: https://datasheet.ciiva.com/46373/1678782-46373340.pdf?src-supplier=Element14; ComponentLink2Description: https://datasheet.ciiva.com/46373/1678782-46373340.pdf?src-supplier=Element14; ComponentLink3URL: https://datasheet.ciiva.com/22673/1678782-22673918.pdf?src-supplier=Element14; ComponentLink3Description: https://datasheet.ciiva.com/22673/1678782-22673918.pdf?src-supplier=Element14; ComponentLink4URL: https://datasheet.ciiva.com/46373/1678782-46373339.pdf?src-supplier=Element14; ComponentLink4Description: https://datasheet.ciiva.com/46373/1678782-46373339.pdf?src-supplier=Element14; ComponentLink5URL: https://datasheet.ciiva.com/24070/aoa0000ce2-24070269.pdf?src-supplier=Mouser; ComponentLink5Description: https://datasheet.ciiva.com/24070/aoa0000ce2-24070269.pdf?src-supplier=Mouser; ComponentLink6URL: https://datasheet.ciiva.com/16768/70260748-16768437.pdf?src-supplier=Allied+Electronics; ComponentLink6Description: https://datasheet.ciiva.com/16768/70260748-16768437.pdf?src-supplier=Allied+Electronics; ComponentLink7URL: https://datasheet.ciiva.com/16774/70260748-16774550.pdf?src-supplier=Allied+Electronics; ComponentLink7Description: https://datasheet.ciiva.com/16774/70260748-16774550.pdf?src-supplier=Allied+Electronics; ComponentLink8URL: https://datasheet.ciiva.com/9198/aoa0000ce2-9198923.pdf?src-supplier=Avnet; ComponentLink8Description: https://datasheet.ciiva.com/9198/aoa0000ce2-9198923.pdf?src-supplier=Avnet; ComponentLink9URL: https://datasheet.ciiva.com/16449/aoa0000ce2-16449065.pdf?src-supplier=Future+Electronics; ComponentLink9Description: https://datasheet.ciiva.com/16449/aoa0000ce2-16449065.pdf?src-supplier=Future+Electronics; ComponentLink10URL: https://datasheet.ciiva.com/48530/aoa0000ce2-48530987.pdf?src-supplier=Avnet; ComponentLink10Description: https://datasheet.ciiva.com/48530/aoa0000ce2-48530987.pdf?src-supplier=Avnet; ComponentLink11URL: https://datasheet.ciiva.com/30063/aoa0000ce2-30063390.pdf?src-supplier=Onlinecomponents.com; ComponentLink11Description: https://datasheet.ciiva.com/30063/aoa0000ce2-30063390.pdf?src-supplier=Onlinecomponents.com; Supplier Part Number 1: C118155
R21 = RES 0603 31.6k 1%: 100mW Thick Film Resistors 75V ±100ppm/℃ ±1% 31.6kΩ 0603 Chip Resistor - Surface Mount ROHS; Manufacturer 1: Yageo; Manufacturer Part Number 1: RC0603FR-0731K6L; Supplier: LCSC; ComponentLink1URL: http://www.mouser.com/ds/2/447/yageodocoutput-1111992.pdf?src-supplier=Mouser; ComponentLink1Description: http://www.mouser.com/ds/2/447/yageodocoutput-1111992.pdf?src-supplier=Mouser; ComponentLink2URL: http://www.yageo.com/NewPortal/yageodocoutput?fileName=/pdf/R-Chip/PYu-AC_51_RoHS_L_6.pdf&src-supplier=Digi-Key; ComponentLink2Description: http://www.yageo.com/NewPortal/yageodocoutput?fileName=/pdf/R-Chip/PYu-AC_51_RoHS_L_6.pdf&src-supplier=Digi-Key; ComponentLink3URL: https://www.yageo.com/upload/media/product/productsearch/datasheet/rchip/PYu-AC_51_RoHS_L_7.pdf?src-supplier=Digi-Key; ComponentLink3Description: https://www.yageo.com/upload/media/product/productsearch/datasheet/rchip/PYu-AC_51_RoHS_L_7.pdf?src-supplier=Digi-Key; Supplier Part Number: C185339; Resistance: 31.6K
R22 = RES 0603 3.83k 1%: 100mW Thick Film Resistors 75V ±100ppm/℃ ±1% 3.83kΩ 0603 Chip Resistor - Surface Mount ROHS; Manufacturer 1: FOJAN; Manufacturer Part Number 1: FRC0603F3831TS; Supplier: LCSC; ComponentLink1URL: http://www.mouser.com/ds/2/447/yageodocoutput-1111992.pdf?src-supplier=Mouser; ComponentLink1Description: http://www.mouser.com/ds/2/447/yageodocoutput-1111992.pdf?src-supplier=Mouser; ComponentLink2URL: http://www.yageo.com/NewPortal/yageodocoutput?fileName=/pdf/R-Chip/PYu-AC_51_RoHS_L_6.pdf&src-supplier=Digi-Key; ComponentLink2Description: http://www.yageo.com/NewPortal/yageodocoutput?fileName=/pdf/R-Chip/PYu-AC_51_RoHS_L_6.pdf&src-supplier=Digi-Key; ComponentLink3URL: https://www.yageo.com/upload/media/product/productsearch/datasheet/rchip/PYu-AC_51_RoHS_L_7.pdf?src-supplier=Digi-Key; ComponentLink3Description: https://www.yageo.com/upload/media/product/productsearch/datasheet/rchip/PYu-AC_51_RoHS_L_7.pdf?src-supplier=Digi-Key; Supplier Part Number: C2933213; Resistance: 3.83K
R23 = RES 0603 10k 1%: 100mW Thick Film Resistors 75V ±100ppm/℃ ±1% 10kΩ 0603 Chip Resistor - Surface Mount ROHS; Manufacturer: YAGEO; Manufacturer Part Number: RC0603FR-0710KL; Supplier: LCSC; Supplier Part Number: C98220; Value: 10k
R24 = RES 0603 590R 1%: 100mW Thick Film Resistors 75V ±100ppm/℃ ±1% 590Ω 0603 Chip Resistor - Surface Mount ROHS; Manufacturer: FOJAN; Manufacturer Part Number: FRC0603F5900TS; Supplier Part Number: C2933241; Supplier: LCSC; Resistance: 590R
R25 = RES 0805 430k 1%: 125mW Thick Film Resistors 150V ±100ppm/℃ ±1% 430kΩ 0805 Chip Resistor - Surface Mount ROHS; Manufacturer Part Number: FRC0805F4303TS; Manufacturer: FOJAN; Supplier: LCSC; Case/Package: 0805; Supplier Part Number: C2930199; Resistance: 430K
R26 = RES 0603 20K 1%: 100mW Thick Film Resistors 75V ±100ppm/℃ ±1% 20kΩ 0603 Chip Resistor - Surface Mount ROHS; Manufacturer: Yageo; Manufacturer Part Number: RC0603FR-0720KL; Resistance: 20K; Supplier: LCSC; Supplier Part Number: C137690
R27 = RES 0603 511R 0.1%: 100mW Thin Film Resistor ±50ppm/℃ ±0.1% 511Ω 0603 Chip Resistor - Surface Mount ROHS; Manufacturer 1: Yageo; Manufacturer Part Number 1: RT0603BRE07511RL; Supplier: LCSC; ComponentLink1URL: http://www.mouser.com/ds/2/447/yageodocoutput-1111992.pdf?src-supplier=Mouser; ComponentLink1Description: http://www.mouser.com/ds/2/447/yageodocoutput-1111992.pdf?src-supplier=Mouser; ComponentLink2URL: http://www.yageo.com/NewPortal/yageodocoutput?fileName=/pdf/R-Chip/PYu-AC_51_RoHS_L_6.pdf&src-supplier=Digi-Key; ComponentLink2Description: http://www.yageo.com/NewPortal/yageodocoutput?fileName=/pdf/R-Chip/PYu-AC_51_RoHS_L_6.pdf&src-supplier=Digi-Key; ComponentLink3URL: https://www.yageo.com/upload/media/product/productsearch/datasheet/rchip/PYu-AC_51_RoHS_L_7.pdf?src-supplier=Digi-Key; ComponentLink3Description: https://www.yageo.com/upload/media/product/productsearch/datasheet/rchip/PYu-AC_51_RoHS_L_7.pdf?src-supplier=Digi-Key; Supplier Part Number: C849795; Resistance: 511R
U1-U3 = TPS54561DPRR: 4.5V to 60V Input 5A Step-Down DC-DC Converter With Soft-Start and Eco-mode 10-WSON -40 to 125; Manufacturer: Texas Instruments; Max Output Voltage: 59V; Min Output Voltage: 800mV; Number of Outputs: 1; Output Configuration: Positive; Output Type: Adjustable; Quiescent Current: 152uA; Switching Frequency: 2.5MHz; Synchronous Rectifier: No; Category: Voltage Regulators - Switching; Lead Free: Lead Free; Manufacturer Part Number: TPS54561DPRR; Max Input Voltage: 60V; Max Operating Temperature: 125°C; Max Output Current: 5A; Min Input Voltage: 4.5V; Min Operating Temperature: -40°C; Mount: Surface Mount; Number of Pins: 10; Operating Supply Voltage: 60V; Output Current: 5A; Output Voltage: 59V; Package Quantity: 3000; Packaging: Tape and Reel; Radiation Hardening: No; RoHS Compliant: Yes
U4 = TPS40170RGYR: Step-down type 4.5V~60V TQFN-20-EP(3.5x4.5) DC-DC Converters ROHS; Manufacturer: Texas Instruments; Manufacturer Part Number: TPS40170RGYR; Supplier: LCSC; Supplier Part Number: C56175
U5 = BA7807FP-E2: 1A 69dB@(120Hz) Fixed 7V Positive electrode 22V TO-252-3 Linear Voltage Regulators (LDO) ROHS; Manufacturer: ROHM Semicon; Supplier: LCSC; Manufacturer Part Number: BA7807FP-E2; Supplier Part Number: C79648
U9 = AMS1117: Manufacturer: Advanced Monolithic Systems; Voltage max: 15V; Current max: 10mA; Operating temperature: 0°C ~ 125°C; HelpURL: https://forum.digikey.com/t/cross-reference-for-ams1117-3-3/4397
VT1 VT2 = SL15N65CD: 650V 15A 83W 205mΩ 205V TO-252 MOSFETs ROHS; Manufacturer: Sikor; Supplier: LCSC; Supplier Part Number: C5632290; Manufacturer Part Number: SL15N65CD